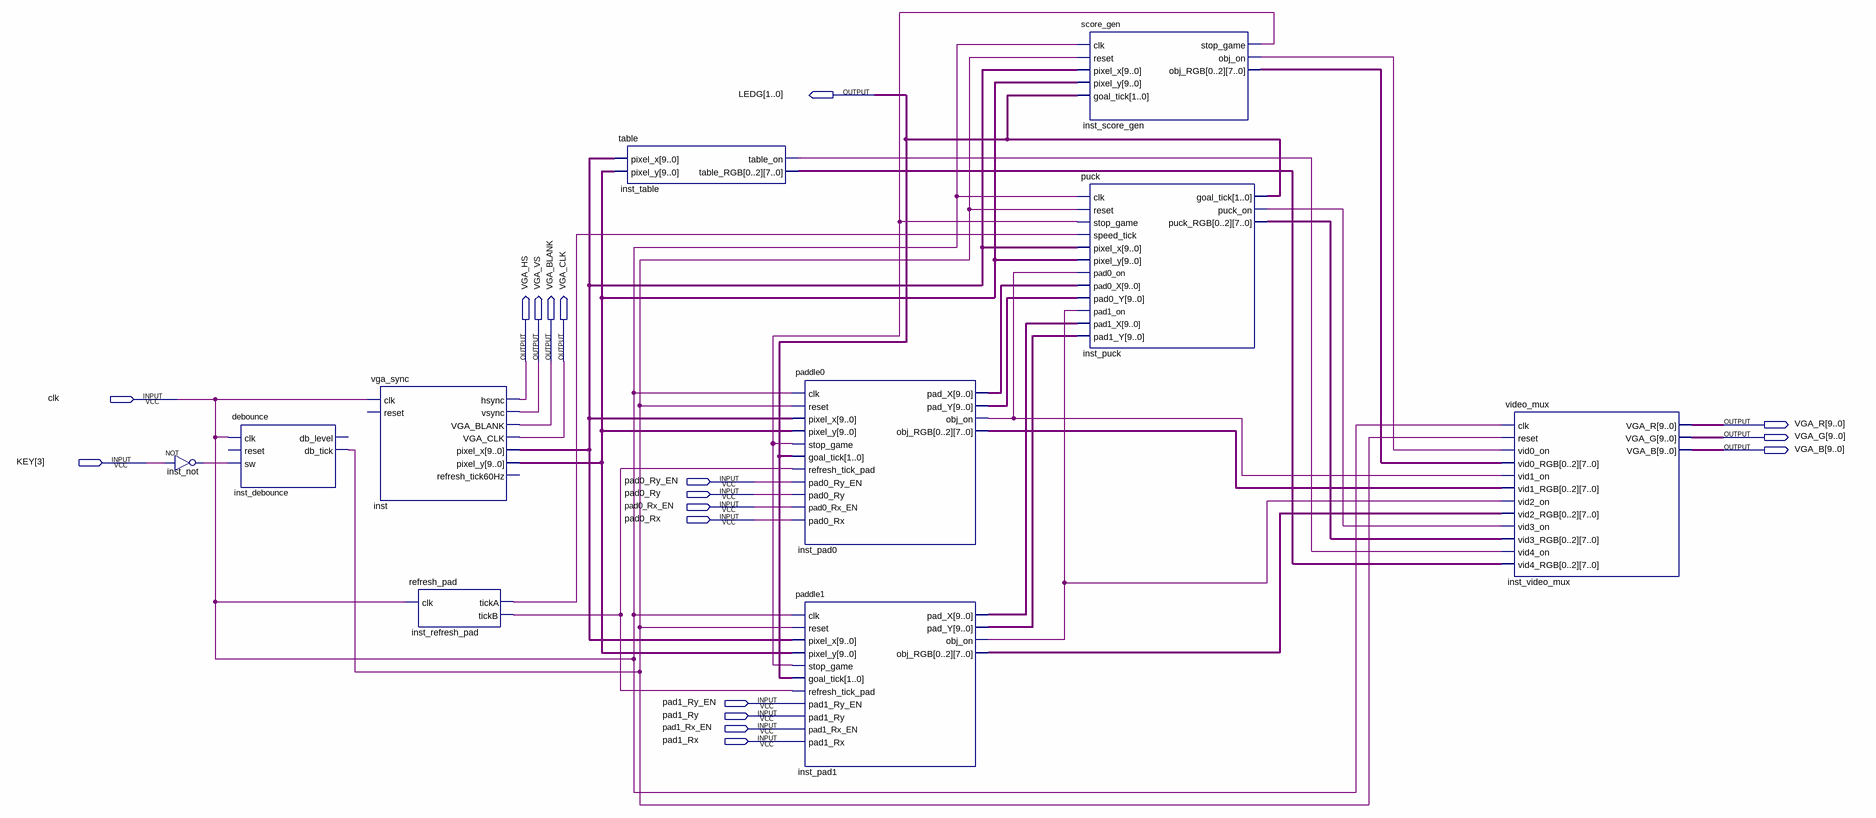
[diagram p0: schematic sheet]
// Quartus schematic schematic.bdf as structural Verilog: 10 symbols, 18 pins
module schematic (
  input  clk,
  input  [3:3] KEY,
  input  pad0_Ry_EN,
  input  pad0_Ry,
  input  pad0_Rx_EN,
  input  pad0_Rx,
  input  pad1_Ry_EN,
  input  pad1_Ry,
  input  pad1_Rx_EN,
  input  pad1_Rx,
  output [1:0] LEDG,
  output VGA_HS,
  output VGA_VS,
  output VGA_BLANK,
  output VGA_CLK,
  output [9:0] VGA_R,
  output [9:0] VGA_G,
  output [9:0] VGA_B
);

  wire inst_debounce_db_tick, inst_not_out, inst_pad0_obj_on, inst_pad1_obj_on, inst_puck_puck_on,
       inst_refresh_pad_ticka, inst_refresh_pad_tickb, inst_score_gen_obj_on, inst_score_gen_stop_game,
       inst_table_table_on;
  wire [9:0] inst_pad0_pad_x, inst_pad0_pad_y, inst_pad1_pad_x, inst_pad1_pad_y, inst_pixel_x, inst_pixel_y;
  wire [23:0] inst_pad0_obj_rgb, inst_pad1_obj_rgb, inst_puck_puck_rgb, inst_score_gen_obj_rgb,
       inst_table_table_rgb;

  not inst_not (inst_not_out, KEY[3]);
  debounce inst_debounce (.clk(clk), .sw(inst_not_out), .db_tick(inst_debounce_db_tick));  // open: reset, db_level
  vga_sync inst (
    .clk(clk), .hsync(VGA_HS), .vsync(VGA_VS), .VGA_BLANK(VGA_BLANK), .VGA_CLK(VGA_CLK),
    .pixel_x(inst_pixel_x), .pixel_y(inst_pixel_y));  // open: reset, refresh_tick60Hz
  refresh_pad inst_refresh_pad (.clk(clk), .tickA(inst_refresh_pad_ticka), .tickB(inst_refresh_pad_tickb));
  \table  inst_table (
    .pixel_x(inst_pixel_x), .pixel_y(inst_pixel_y), .table_on(inst_table_table_on),
    .table_RGB(inst_table_table_rgb));
  paddle0 inst_pad0 (
    .clk(clk), .reset(inst_debounce_db_tick), .pixel_x(inst_pixel_x), .pixel_y(inst_pixel_y),
    .stop_game(inst_score_gen_stop_game), .goal_tick(LEDG), .refresh_tick_pad(inst_refresh_pad_tickb),
    .pad0_Ry_EN(pad0_Ry_EN), .pad0_Ry(pad0_Ry), .pad0_Rx_EN(pad0_Rx_EN), .pad0_Rx(pad0_Rx),
    .pad_X(inst_pad0_pad_x), .pad_Y(inst_pad0_pad_y), .obj_on(inst_pad0_obj_on), .obj_RGB(inst_pad0_obj_rgb));
  paddle1 inst_pad1 (
    .clk(clk), .reset(inst_debounce_db_tick), .pixel_x(inst_pixel_x), .pixel_y(inst_pixel_y),
    .stop_game(inst_score_gen_stop_game), .goal_tick(LEDG), .refresh_tick_pad(inst_refresh_pad_tickb),
    .pad1_Ry_EN(pad1_Ry_EN), .pad1_Ry(pad1_Ry), .pad1_Rx_EN(pad1_Rx_EN), .pad1_Rx(pad1_Rx),
    .pad_X(inst_pad1_pad_x), .pad_Y(inst_pad1_pad_y), .obj_on(inst_pad1_obj_on), .obj_RGB(inst_pad1_obj_rgb));
  score_gen inst_score_gen (
    .clk(clk), .reset(inst_debounce_db_tick), .pixel_x(inst_pixel_x), .pixel_y(inst_pixel_y),
    .goal_tick(LEDG), .stop_game(inst_score_gen_stop_game), .obj_on(inst_score_gen_obj_on),
    .obj_RGB(inst_score_gen_obj_rgb));
  puck inst_puck (
    .clk(clk), .reset(inst_debounce_db_tick), .stop_game(inst_score_gen_stop_game),
    .speed_tick(inst_refresh_pad_ticka), .pixel_x(inst_pixel_x), .pixel_y(inst_pixel_y),
    .pad0_on(inst_pad0_obj_on), .pad0_X(inst_pad0_pad_x), .pad0_Y(inst_pad0_pad_y),
    .pad1_on(inst_pad1_obj_on), .pad1_X(inst_pad1_pad_x), .pad1_Y(inst_pad1_pad_y), .goal_tick(LEDG),
    .puck_on(inst_puck_puck_on), .puck_RGB(inst_puck_puck_rgb));
  video_mux inst_video_mux (
    .clk(clk), .reset(inst_debounce_db_tick), .vid0_on(inst_score_gen_obj_on),
    .vid0_RGB(inst_score_gen_obj_rgb), .vid1_on(inst_pad0_obj_on), .vid1_RGB(inst_pad0_obj_rgb),
    .vid2_on(inst_pad1_obj_on), .vid2_RGB(inst_pad1_obj_rgb), .vid3_on(inst_puck_puck_on),
    .vid3_RGB(inst_puck_puck_rgb), .vid4_on(inst_table_table_on), .vid4_RGB(inst_table_table_rgb),
    .VGA_R(VGA_R), .VGA_G(VGA_G), .VGA_B(VGA_B));
endmodule
